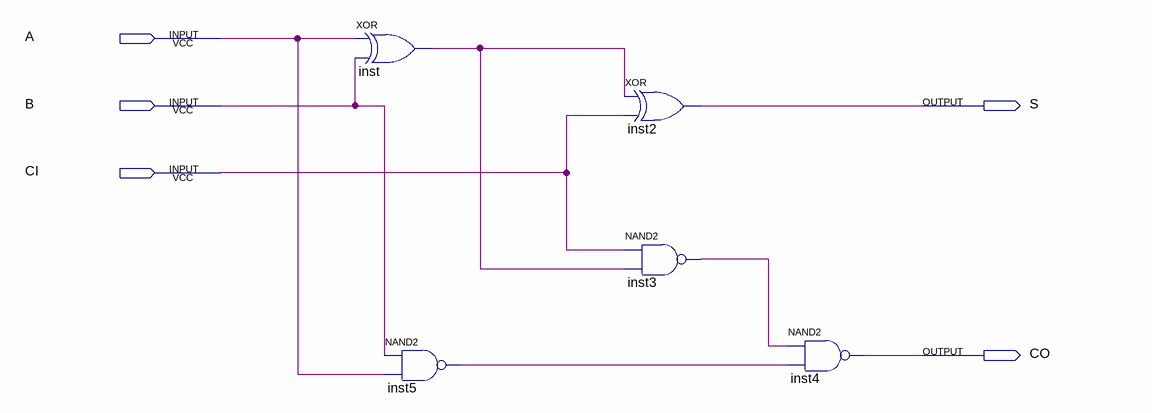
[diagram p0: schematic sheet]
// Quartus schematic full_adder.bdf as structural Verilog: 5 symbols, 5 pins
module full_adder (
  input  A,
  input  B,
  input  CI,
  output S,
  output CO
);

  wire inst3_out, inst5_out, inst_out;

  xor inst (inst_out, A, B);
  nand inst5 (inst5_out, B, A);
  xor inst2 (S, inst_out, CI);
  nand inst3 (inst3_out, CI, inst_out);
  nand inst4 (CO, inst3_out, inst5_out);
endmodule
